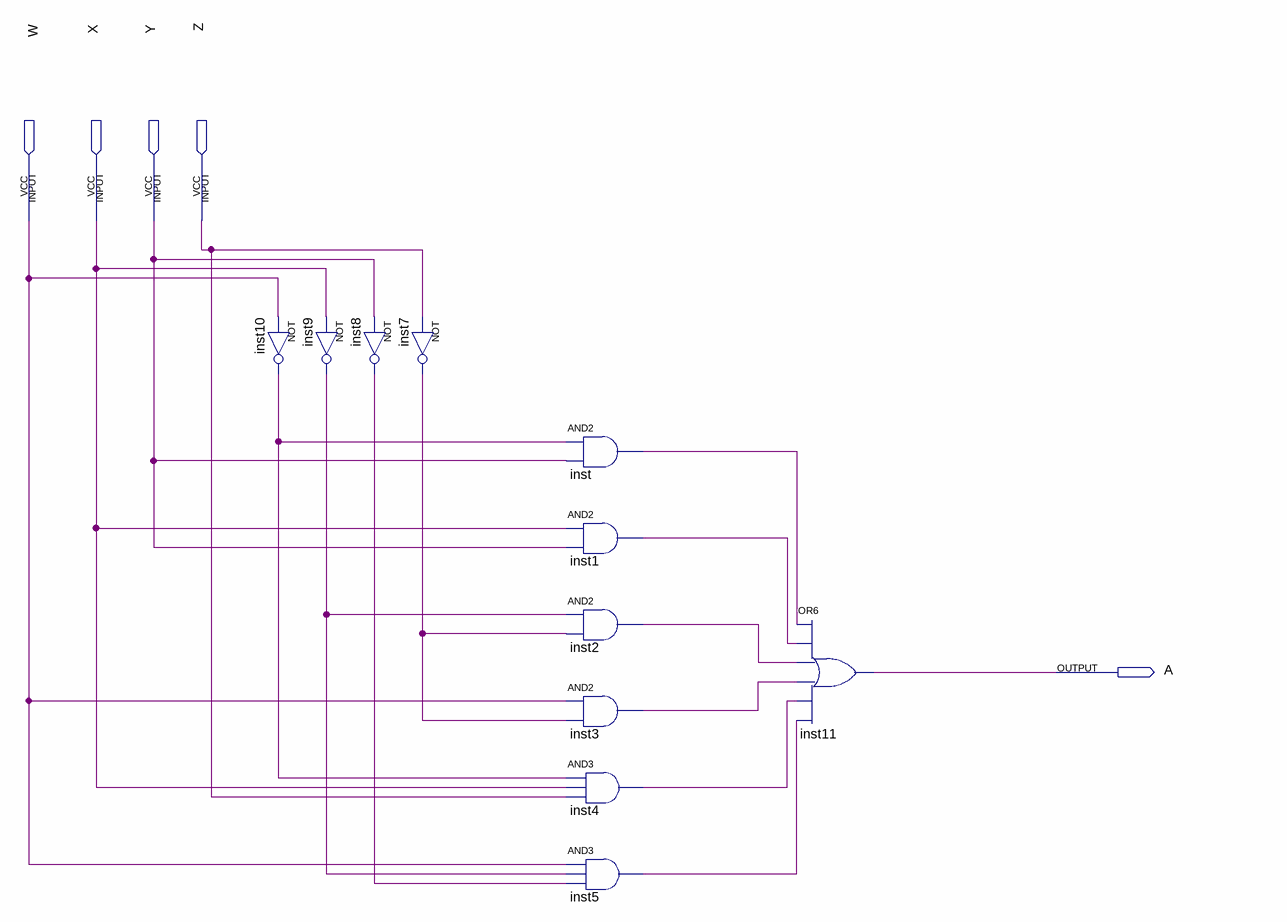
[diagram p0: schematic sheet]
// Quartus schematic SEG_A.bdf as structural Verilog: 11 symbols, 5 pins
module SEG_A (
  input  W,
  input  X,
  input  Y,
  input  Z,
  output A
);

  wire inst1_out, inst2_out, inst3_out, inst4_out, inst5_out, inst7_out, inst8_out, inst9_out, inst10_out,
       inst_out;

  not inst9 (inst9_out, X);
  not inst10 (inst10_out, W);
  not inst7 (inst7_out, Z);
  not inst8 (inst8_out, Y);
  and inst (inst_out, inst10_out, Y);
  and inst1 (inst1_out, X, Y);
  and inst2 (inst2_out, inst9_out, inst7_out);
  and inst3 (inst3_out, W, inst7_out);
  and inst4 (inst4_out, inst10_out, X, Z);
  and inst5 (inst5_out, W, inst9_out, inst8_out);
  or inst11 (A, inst_out, inst1_out, inst2_out, inst3_out, inst4_out, inst5_out);
endmodule
